# Altium schematic sheet STice.SchDoc
size A4; Revision: A.1(PCB.SCH)
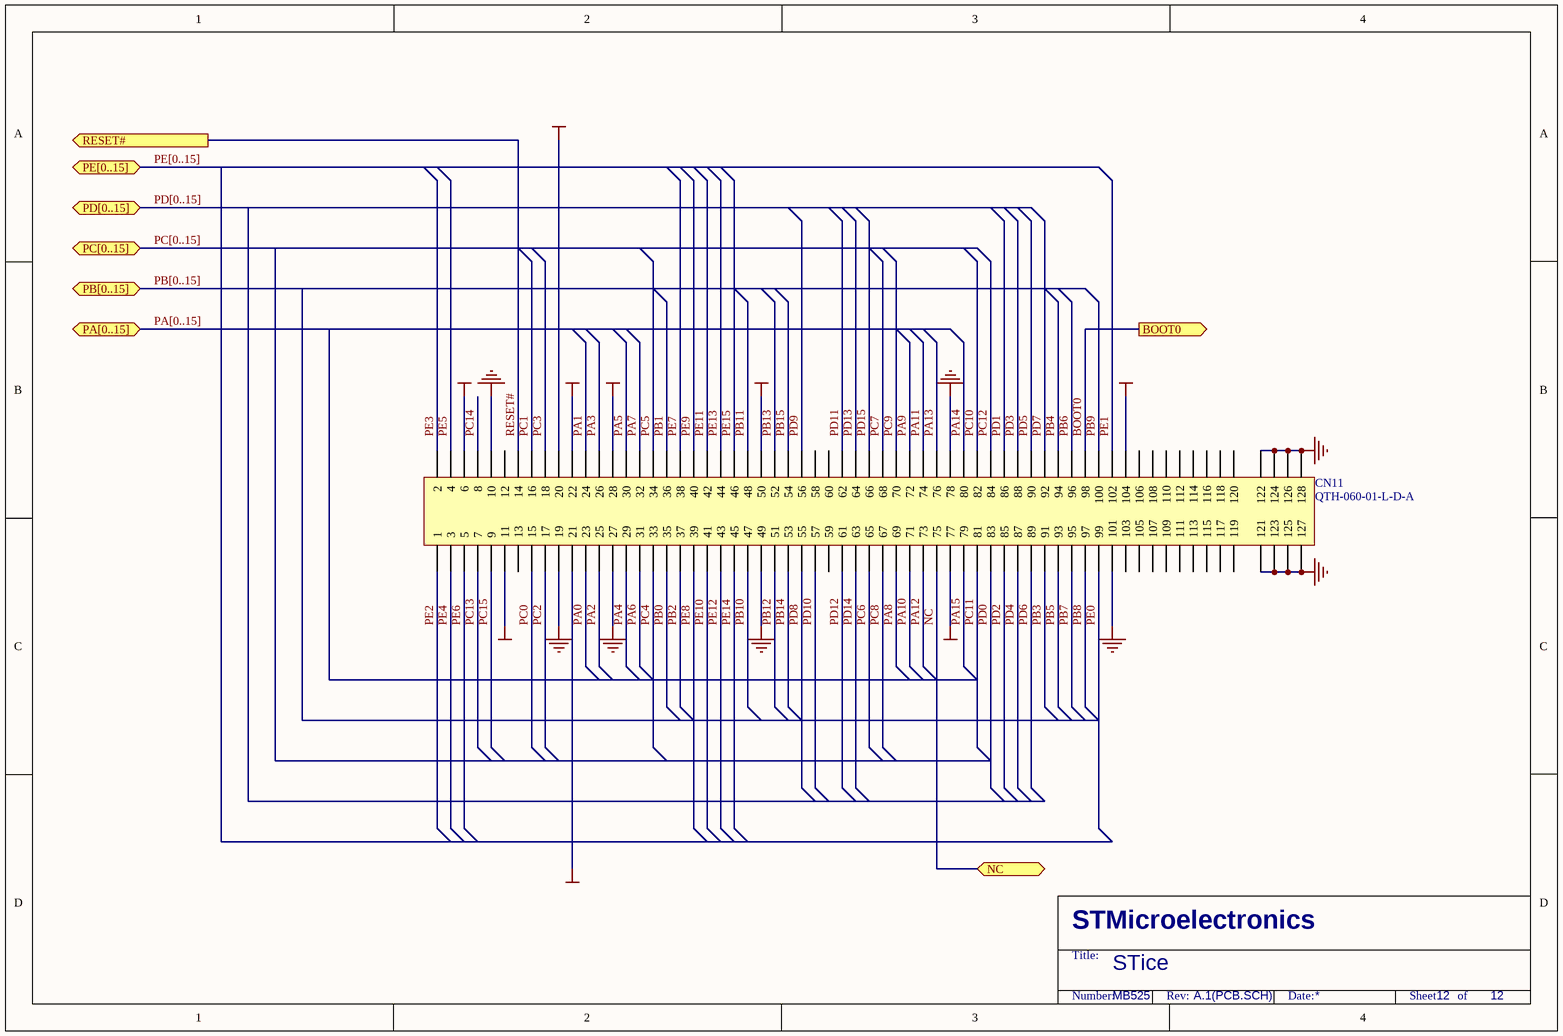
[diagram p0: STice.SchDoc]

## Parts
CN11  QTH-060-01-L-D-A  [QTH-060-01-L-D-A]

## Ports
BOOT0 (out), NC, PA[0..15] (bidir), PB[0..15] (bidir), PC[0..15] (bidir), PD[0..15] (bidir), PE[0..15] (bidir), RESET# (out)

## Nets
GND: CN11.10 CN11.19 CN11.27 CN11.49 CN11.78 CN11.101 CN11.121 CN11.122 CN11.123 CN11.124 CN11.125 CN11.126 CN11.127 CN11.128
Vbat: CN11.6
VDD: CN11.11 CN11.28 CN11.50 CN11.77 CN11.104
VDDA: CN11.22
VREF+: CN11.21
VREF-: CN11.20
BOOT0: CN11.98 ; port BOOT0
NC: CN11.75 ; port NC
PA0: CN11.23
PA1: CN11.24
PA2: CN11.25
PA3: CN11.26
PA4: CN11.29
PA5: CN11.30
PA6: CN11.31
PA7: CN11.32
PA8: CN11.69
PA9: CN11.72
PA10: CN11.71
PA11: CN11.74
PA12: CN11.73
PA13: CN11.76
PA14: CN11.80
PA15: CN11.79
PB0: CN11.35
PB1: CN11.36
PB2: CN11.37
PB3: CN11.91
PB4: CN11.94
PB5: CN11.93
PB6: CN11.96
PB7: CN11.95
PB8: CN11.97
PB9: CN11.100
PB10: CN11.47
PB11: CN11.48
PB12: CN11.51
PB13: CN11.52
PB14: CN11.53
PB15: CN11.54
PC0: CN11.15
PC1: CN11.16
PC2: CN11.17
PC3: CN11.18
PC4: CN11.33
PC5: CN11.34
PC6: CN11.65
PC7: CN11.68
PC8: CN11.67
PC9: CN11.70
PC10: CN11.82
PC11: CN11.81
PC12: CN11.84
PC13: CN11.7
PC14: CN11.8
PC15: CN11.9
PD0: CN11.83
PD1: CN11.86
PD2: CN11.85
PD3: CN11.88
PD4: CN11.87
PD5: CN11.90
PD6: CN11.89
PD7: CN11.92
PD8: CN11.55
PD9: CN11.56
PD10: CN11.57
PD11: CN11.62
PD12: CN11.61
PD13: CN11.64
PD14: CN11.63
PD15: CN11.66
PE0: CN11.99
PE1: CN11.102
PE2: CN11.1
PE3: CN11.2
PE4: CN11.3
PE5: CN11.4
PE6: CN11.5
PE7: CN11.38
PE8: CN11.39
PE9: CN11.40
PE10: CN11.41
PE11: CN11.42
PE12: CN11.43
PE13: CN11.44
PE14: CN11.45
PE15: CN11.46
RESET#: CN11.14 ; port RESET#

Not connected (* = marked no-connect by the designer): CN11 12 13 58 59 60 103 105 106 107 108 109 110 111 112 113 114 115 116 117 118 119 120

## Buses and harness runs
bus PA[0..15] = port PA[0..15]
bus PB[0..15] = port PB[0..15]
bus PC[0..15] = port PC[0..15]
bus PD[0..15] = port PD[0..15]
bus PE[0..15] = port PE[0..15]

## Notes on the sheet
- STice
- MB525
- 12
- STMicroelectronics
- Title:
- Number:
- Rev:
- Date:
- Sheet       of